# Altium project Milander_DebugBoardV1.PrjPcb
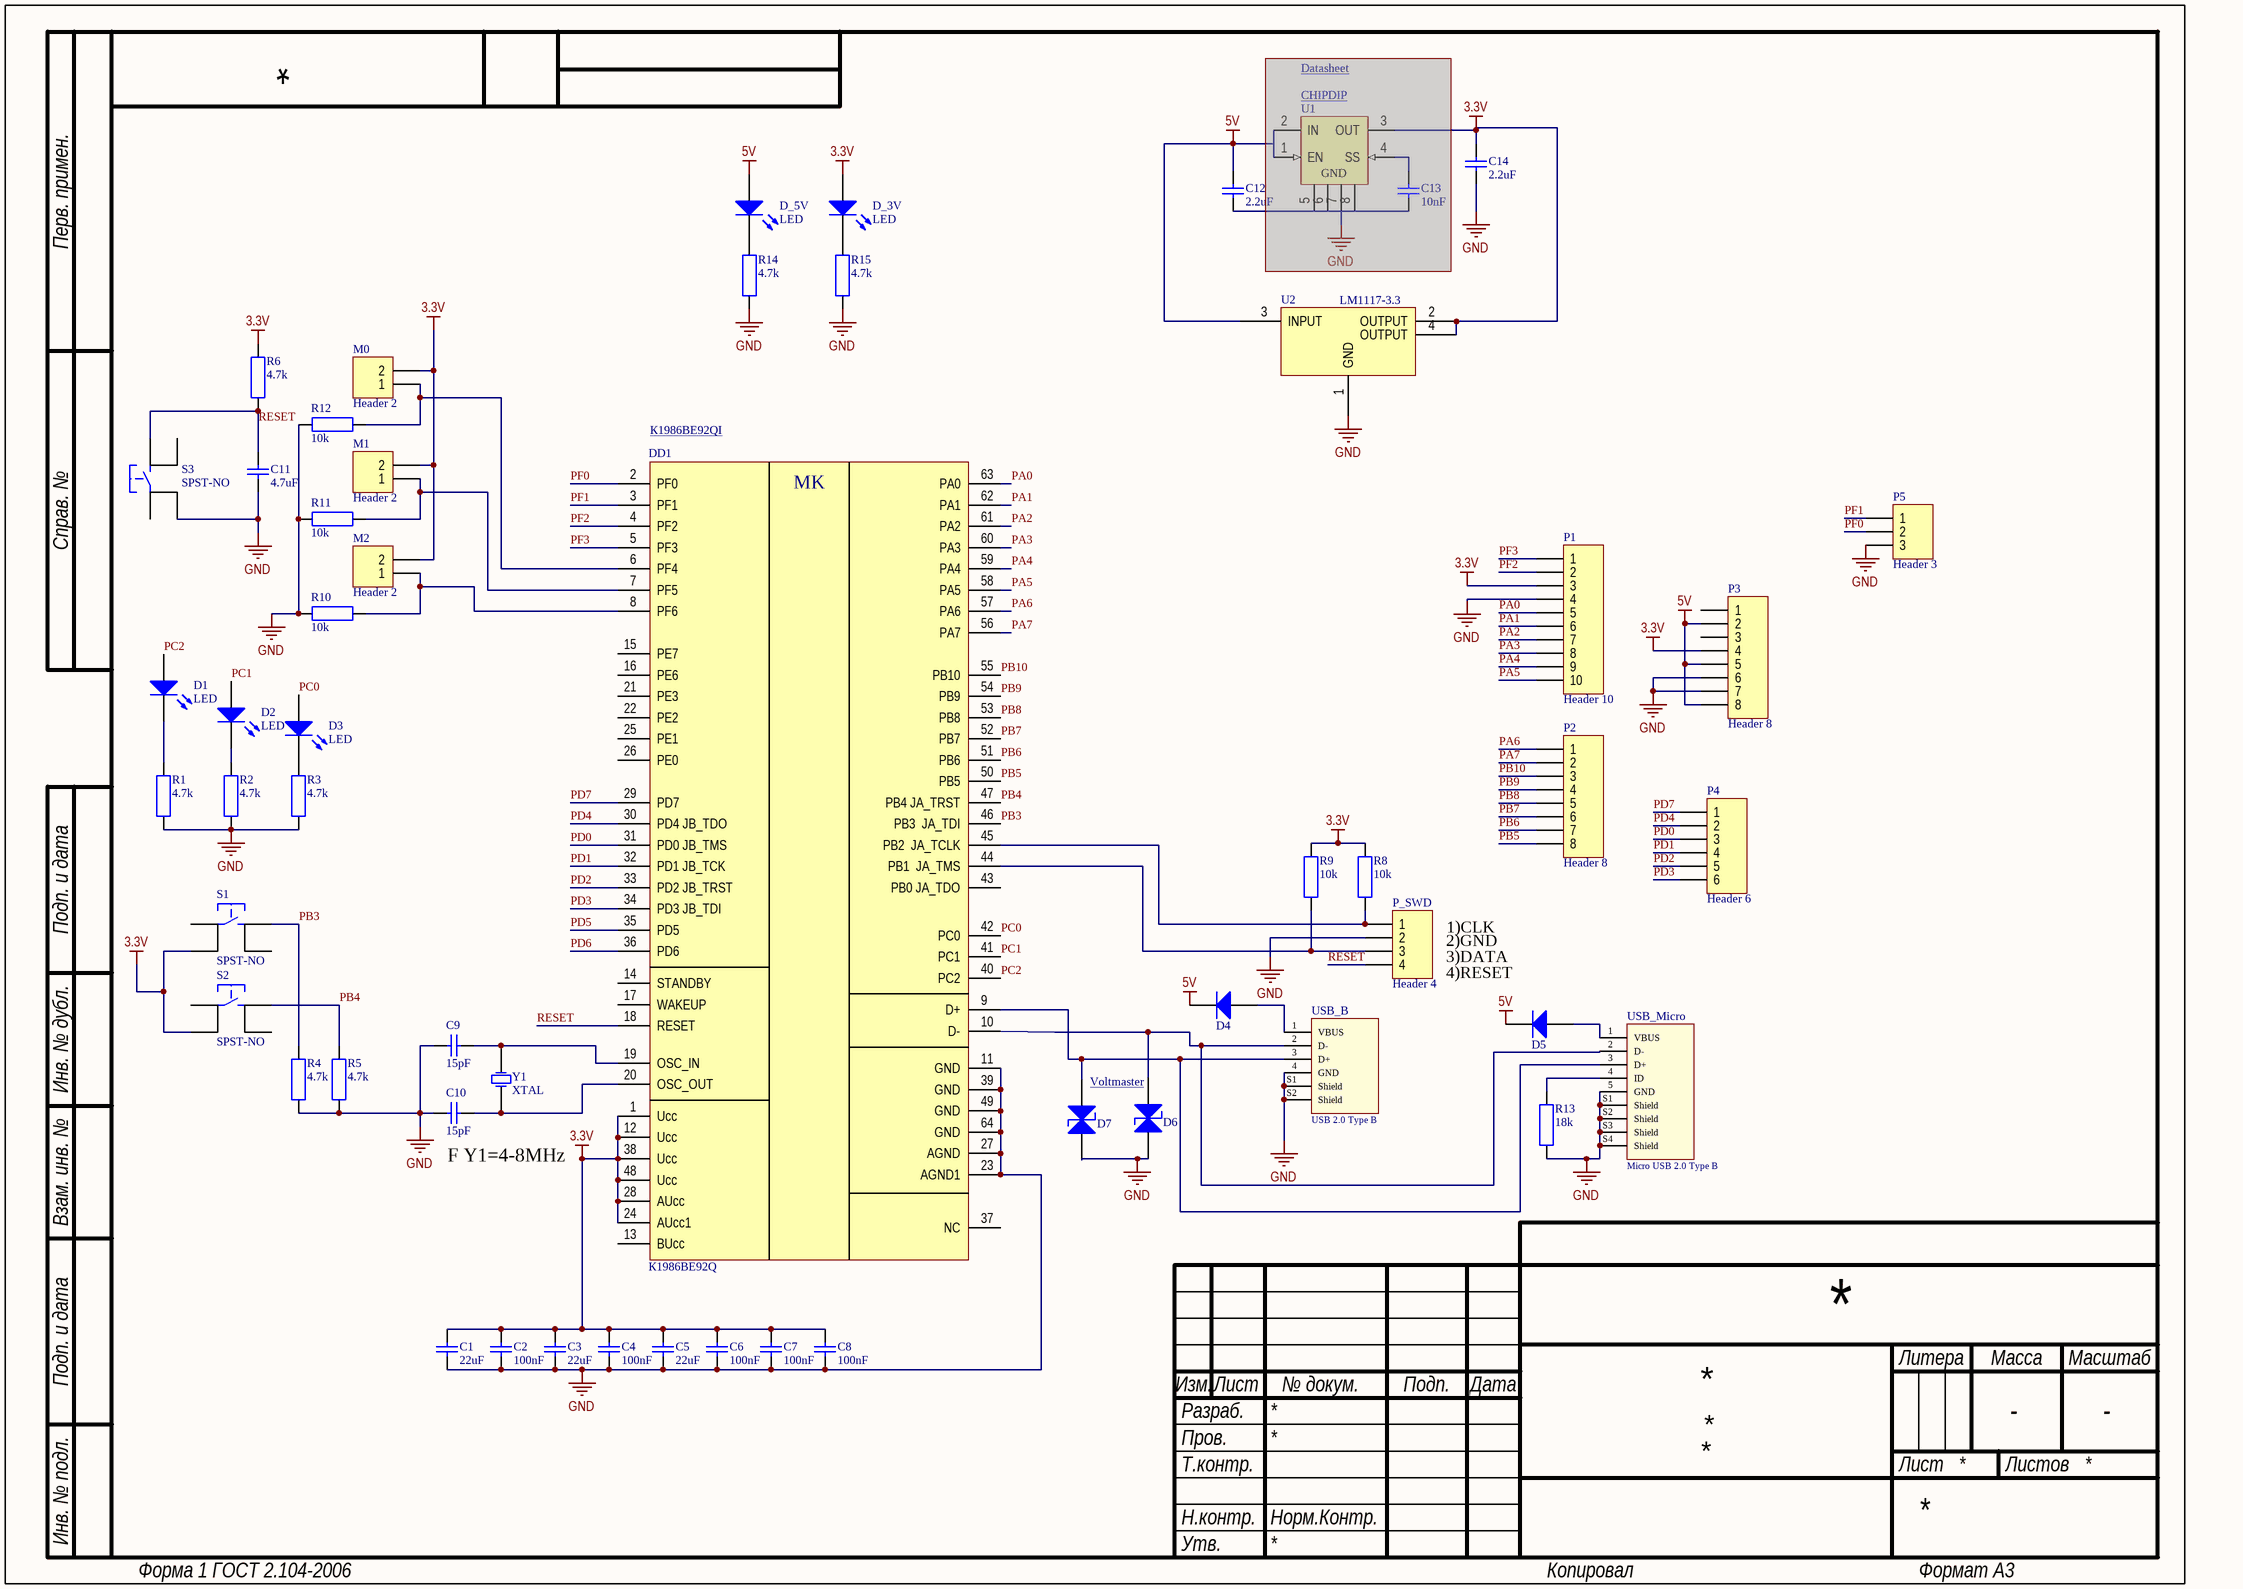
[diagram p0: SCH_BoargV1_2.SchDoc]
2 sheets, 112 parts. Net scope: global (net labels, ports and power ports of the same name join across sheets).
Board files: PCB_BoargV1.PcbDoc, PCB_BoargV1_1.PcbDoc, PCB_BoargV1_2.PcbDoc, PCB_BoargV1_3.PcbDoc
Sheets:
  SCH_BoargV1_2.SchDoc
  SCH_BoargV1.SchDoc

## Sheet SCH_BoargV1_2.SchDoc
size 420 x 297 mm; PageSetup: Record=PageOptions|CenterHorizontal=True|CenterVertical=True|PrintScale=1.00|XCorrection=1.00|YCorrection=1.00|PrintKind=1|BorderSize=5000000|LeftOffset=0|BottomOffset=0|Orientation=2|PaperLength=1000|PaperWidth=1000|Scale=100|PaperSource=15|PrintQuality=1200|MediaType=1|DitherType=10|PaperKind=A3|PrintScaleMode=1; Weight: -; ScaleFactor: -; NormInspection: Норм.Контр.; Scale: 1:1; Разраб.: Иванов; Обозначение документа: АБВГ.123456.001 Э3; Пров.: Петров; Утв.: Сидоров; Наименование организации: ОАО "Концерн "МПО-Гидроприбор"; Перв. применение: АБВГ.123456.000; Наименование изделия 1: Плата; Наименование изделия 2: Схема электрическая; Наименование изделия 3: принципиальная; Нач. отд.: Нач. отд.; Фамилия нач. отд.: Сидоров

### Parts
(Parts that share a designator on the sheet are numbered #1, #2 ... from top to bottom, then left to right.)
C1#1  value 22uF  [C0805C]  (hidden comment: CAP)
C2#1  value 100nF  [C0805C]  (hidden comment: CAP)
C3#1  value 22uF  [C0805C]  (hidden comment: CAP)
C4#1  value 100nF  [C0805C]  (hidden comment: CAP)
C5#1  value 22uF  [C0805C]  (hidden comment: CAP)
C6#1  value 100nF  [C0805C]  (hidden comment: CAP)
C7#1  value 100nF  [C0805C]  (hidden comment: CAP)
C8#1  value 100nF  [C0805C]  (hidden comment: CAP)
C9#1  value 15pF  [C0805C]  (hidden comment: CAP)
C10#1  value 15pF  [C0805C]  (hidden comment: CAP)
C11#1  value 4.7uF  [C0805C]  (hidden comment: CAP)
C12#1  value 2.2uF  [C0805C]  (hidden comment: CAP)
C13#1  value 10nF  [C0805C]  (hidden comment: CAP)  (masked out: inside a compile mask, not in the netlist)
C14#1  value 2.2uF  [C0805C]  (hidden comment: CAP)
D1#1  LED  [LED1206G]
D2#1  LED  [LED1206R]
D3#1  LED  [LED1206Y]
D4#1  Diode  [DSO-C2/X1.8]  (value not drawn)
D5#1  Diode  [DSO-C2/X1.8]  (value not drawn)
D6#1  DiodeTVS  [DIOM4336X22N]  (value not drawn)
D7#1  DiodeTVS  [DIOM4336X22N]  (value not drawn)
D_3V#1  LED  [LED1206R]
D_5V#1  LED  [LED1206R]
DD1#1  К1986ВЕ92Q  [TSQFP50P1200X1200X160-64N]
M0#1  Header 2  [HDR1X2J]
M1#1  Header 2  [HDR1X2J]
M2#1  Header 2  [HDR1X2J]
P1#1  Header 10  [HDR1X10]
P2  Header 8  [HDR1X8]
P3  Header 8  [HDR1X8]
P4  Header 6  [HDR1X6]
P5  Header 3  [HDR1X3]
P_SWD#1  Header 4  [HDR1X4]
R1#1  value 4.7k  [C0805R]  (hidden comment: RES)
R2#1  value 4.7k  [C0805R]  (hidden comment: RES)
R3#1  value 4.7k  [C0805R]  (hidden comment: RES)
R4#1  value 4.7k  [C0805R]  (hidden comment: RES)
R5#1  value 4.7k  [C0805R]  (hidden comment: RES)
R6#1  value 4.7k  [C0805R]  (hidden comment: RES)
R8#1  value 10k  [C0805R]  (hidden comment: RES)
R9#1  value 10k  [C0805R]  (hidden comment: RES)
R10#1  value 10k  [C0805R]  (hidden comment: RES)
R11#1  value 10k  [C0805R]  (hidden comment: RES)
R12#1  value 10k  [C0805R]  (hidden comment: RES)
R13#1  value 18k  [C0805R]  (hidden comment: RES)
R14#1  value 4.7k  [C0805R]  (hidden comment: RES)
R15#1  value 4.7k  [C0805R]  (hidden comment: RES)
S1#1  SPST-NO  [SPST-NO]
S2#1  SPST-NO  [SPST-NO]
S3#1  SPST-NO  [SPST-NO]
U1#1  ADP1715ARMZ-3.3-R7  [ADI-RM-8_N]  (value not drawn)  (masked out: inside a compile mask, not in the netlist)
U2  LM1117-3.3  [SOT-223]
USB_B  USB 2.0 Type B  [61400416121]
USB_Micro#1  Micro USB 2.0 Type B  [629105136821]
Y1#1  XTAL  [HC49SMD C]

### Nets
3.3V: C1#1.2 C2#1.2 C3#1.2 C4#1.2 C5#1.2 C6#1.2 C7#1.2 C8#1.2 C14#1.2 D_3V#1.1(A) DD1#1.1(Ucc) DD1#1.12(Ucc) DD1#1.24(AUcc1) DD1#1.28(AUcc) DD1#1.38(Ucc) DD1#1.48(Ucc) M0#1.2 M1#1.2 M2#1.2 P1#1.3 P3.4 R6#1.1 R8#1.2 R9#1.2 S1#1.2 S2#1.2 U2.2(OUTPUT) U2.4(OUTPUT)
5V: C12#1.2 D4#1.K D5#1.K D_5V#1.1(A) P3.2 P3.5 P3.8 U2.3(INPUT)
GND: C1#1.1 C2#1.1 C3#1.1 C4#1.1 C5#1.1 C6#1.1 C7#1.1 C8#1.1 C9#1.2 C10#1.2 C11#1.1 C14#1.1 D6#1.A D7#1.A DD1#1.11(GND) DD1#1.23(AGND1) DD1#1.27(AGND) DD1#1.39(GND) DD1#1.49(GND) DD1#1.64(GND) P1#1.4 P3.6 P3.7 P5.3 P_SWD#1.2 R1#1.1 R2#1.1 R3#1.1 R4#1.1 R5#1.1 R10#1.2 R11#1.1 R12#1.1 R13#1.1 R14#1.1 R15#1.1 S3#1.2 U2.1(GND) USB_B.4(GND) USB_B.S1(Shield) USB_B.S2(Shield) USB_Micro#1.5(GND) USB_Micro#1.S1(Shield) USB_Micro#1.S2(Shield) USB_Micro#1.S3(Shield) USB_Micro#1.S4(Shield)
PA0: DD1#1.63(PA0) P1#1.5
PA1: DD1#1.62(PA1) P1#1.6
PA2: DD1#1.61(PA2) P1#1.7
PA3: DD1#1.60(PA3) P1#1.8
PA4: DD1#1.59(PA4) P1#1.9
PA5: DD1#1.58(PA5) P1#1.10
PA6: DD1#1.57(PA6) P2.1
PA7: DD1#1.56(PA7) P2.2
PB3: DD1#1.46(PB3__JA_TDI) R4#1.2 S1#1.4
PB4: DD1#1.47(PB4_JA_TRST) R5#1.2 S2#1.4
PB5: DD1#1.50(PB5) P2.8
PB6: DD1#1.51(PB6) P2.7
PB7: DD1#1.52(PB7) P2.6
PB8: DD1#1.53(PB8) P2.5
PB9: DD1#1.54(PB9) P2.4
PB10: DD1#1.55(PB10) P2.3
PC0: D3#1.1(A) DD1#1.42(PC0)
PC1: D2#1.1(A) DD1#1.41(PC1)
PC2: D1#1.1(A) DD1#1.40(PC2)
PD0: DD1#1.31(PD0_JB_TMS) P4.3
PD1: DD1#1.32(PD1_JB_TCK) P4.4
PD2: DD1#1.33(PD2_JB_TRST) P4.5
PD3: DD1#1.34(PD3_JB_TDI) P4.6
PD4: DD1#1.30(PD4_JB_TDO) P4.2
PD5: DD1#1.35(PD5)
PD6: DD1#1.36(PD6)
PD7: DD1#1.29(PD7) P4.1
PF0: DD1#1.2(PF0) P5.2
PF1: DD1#1.3(PF1) P5.1
PF2: DD1#1.4(PF2) P1#1.2
PF3: DD1#1.5(PF3) P1#1.1
RESET: C11#1.2 DD1#1.18(RESET) P_SWD#1.4 R6#1.2 S3#1.4
NetC9#1_1: C9#1.1 DD1#1.19(OSC_IN) Y1#1.2(OSC2)
NetC10#1_1: C10#1.1 DD1#1.20(OSC_OUT) Y1#1.1(OSC1)
NetD1#1_2: D1#1.2(K) R1#1.2
NetD2#1_2: D2#1.2(K) R2#1.2
NetD3#1_2: D3#1.2(K) R3#1.2
NetD4#1_A: D4#1.A USB_B.1(VBUS)
NetD5#1_A: D5#1.A USB_Micro#1.1(VBUS)
NetD6#1_K: D6#1.K DD1#1.10(D-) USB_B.2(D-) USB_Micro#1.2(D-)
NetD7#1_K: D7#1.K DD1#1.9(D+) USB_B.3(D+) USB_Micro#1.3(D+)
NetD_3V#1_2: D_3V#1.2(K) R15#1.2
NetD_5V#1_2: D_5V#1.2(K) R14#1.2
NetDD1#1_6: DD1#1.6(PF4) M0#1.1 R12#1.2
NetDD1#1_7: DD1#1.7(PF5) M1#1.1 R11#1.2
NetDD1#1_8: DD1#1.8(PF6) M2#1.1 R10#1.1
NetDD1#1_44: DD1#1.44(PB1__JA_TMS) P_SWD#1.3 R9#1.1
NetDD1#1_45: DD1#1.45(PB2__JA_TCLK) P_SWD#1.1 R8#1.1
NetR13#1_2: R13#1.2 USB_Micro#1.4(ID)

Not connected (* = marked no-connect by the designer): C12#1 1; DD1#1 13(BUcc) 14(STANDBY) 15(PE7) 16(PE6) 17(WAKEUP) 21(PE3) 22(PE2) 25(PE1) 26(PE0) 37(NC) 43(PB0_JA_TDO); P3 1 3; S1#1 1 3; S2#1 1 3; S3#1 1 3

### Notes on the sheet
- Datasheet <https://www.analog.com/media/en/technical-documentation/data-sheets/ADP1715_1716.pdf>
- (near U1#1) CHIPDIP <https://www.chipdip.ru/product1/8001055314>
- (near DD1#1) К1986ВЕ92QI <https://ic.milandr.ru/products/mikrokontrollery_i_protsessory/k1986ve92qi/>
- 1)CLK
- 3)DATA
- (near P_SWD#1) 2)GND
- 4)RESET
- Voltmaster <http://www.voltmaster.ru/cgi-bin/qwery.pl/id=2010076902>
- (near C10#1) F Y1=4-8MHz
- Перв. примен.
- Справ. №
- Подп. и дата
- Инв. № дубл.
- Взам. инв. №
- Разраб.
- Изм.
- Лист
- № докум.
- Подп.
- Дата
- Литера
- Масса
- Масштаб
- Пров.
- Т.контр.
- Листов
- Инв. № подл.
- Н.контр.
- Утв.
- Форма 1 ГОСТ 2.104-2006
- Копировал
- Формат А3
- (in symbol К1986ВЕ92Q) MK

### Library data of the parts
C1#1 C2#1 C3#1 C4#1 C5#1 C6#1 C7#1 C8#1 C9#1 C10#1 C11#1 C12#1 C13#1 C14#1 = CAP: Capacitor; Published: 8-Jun-2000; LatestRevisionDate: 29-May-2009; LatestRevisionNote: IPC-7351 Footprint Added.; PackageReference: C1206; Publisher: Altium Limited; PackageDescription: Chip Capacitor
D1#1 D2#1 D3#1 D_3V#1 D_5V#1 = LED: Typical LED; Published: 8-Jun-2000; LatestRevisionDate: 17-Jul-2002; LatestRevisionNote: Re-released for DXP Platform.; PackageVersion: Feb-2002; PackageReference: 3.2X1.6X1.1; Publisher: Altium Limited; PackageDescription: SM LED; 2 Flat Leads
D4#1 D5#1 = Diode: Default Diode; Published: 8-Jun-2000; LatestRevisionDate: 17-Jul-2002; LatestRevisionNote: Re-released for DXP Platform.; PackageVersion: Sep-1996; PackageReference: SMC; Publisher: Altium Limited; PackageDescription: DO-214-AB/SMC; 2 C-Bend Leads; Body 7.9 x 5.9 mm, inc. leads (LxW); Code_JEDEC: DO-214-AB
D6#1 D7#1 = DiodeTVS: Diode TVS; Published: 8-Jun-2000; LatestRevisionDate: 17-Jul-2002; LatestRevisionNote: Re-released for DXP Platform.; PackageVersion: Sep-1996; PackageReference: SMC; Publisher: Altium Limited; PackageDescription: DO-214-AB/SMC; 2 C-Bend Leads; Body 7.9 x 5.9 mm, inc. leads (LxW); Code_JEDEC: DO-214-AB
M0#1 M1#1 M2#1 = Header 2: Header, 2-Pin; LatestRevisionDate: 17-Jul-2002; LatestRevisionNote: Re-released for DXP Platform.; Publisher: Altium Limited
P1#1 = Header 10: Header, 10-Pin; LatestRevisionDate: 17-Jul-2002; LatestRevisionNote: Re-released for DXP Platform.; Publisher: Altium Limited
P2 P3 = Header 8: Header, 8-Pin; LatestRevisionDate: 17-Jul-2002; LatestRevisionNote: Re-released for DXP Platform.; Publisher: Altium Limited
P4 = Header 6: Header, 6-Pin; LatestRevisionDate: 17-Jul-2002; LatestRevisionNote: Re-released for DXP Platform.; Publisher: Altium Limited
P5 = Header 3: Header, 3-Pin; LatestRevisionDate: 17-Jul-2002; LatestRevisionNote: Re-released for DXP Platform.; Publisher: Altium Limited
P_SWD#1 = Header 4: Header, 4-Pin; LatestRevisionDate: 17-Jul-2002; LatestRevisionNote: Re-released for DXP Platform.; Publisher: Altium Limited
R1#1 R2#1 R3#1 R4#1 R5#1 R6#1 R8#1 R9#1 R10#1 R11#1 R12#1 R13#1 R14#1 R15#1 = RES: Resistor; Published: 8-Jun-2000; LatestRevisionDate: 29-May-2009; LatestRevisionNote: IPC-7351 Footprint Added.; PackageReference: J1-0603; Publisher: Altium Limited; PackageDescription: Chip Resistor
S1#1 S2#1 S3#1 = SPST-NO: Tactile Switch 7.3mm, SMD
U1#1 = ADP1715ARMZ-3.3-R7: 500 mA, Low Dropout, CMOS Linear Regulator, 2.5 to 5.5 V Vin, 3.3 V Vout, Industrial, 8-pin SOP (RM-8), Reel; Manufacturer: Analog Devices; Iout max: 500mA; Preset Vout Values (V): 3.3; Supply Current IGND @ Small Load: 65uA; Vin (max) (V): 5.5; Vin (min) (V): 2.5; DatasheetVersion: Rev. 0; PackageVersion: Aug-05; PackageReference: RM-8; PackageDescription: 8-Pin Mini Small Outline Package, Body 3 x 3 mm, Pitch 0.65 mm; Supplier 1: Digi-Key; Supplier Part Number 1: ADP1715ARMZ-3.3-R7TR-ND; Supplier 2: Digi-Key; Supplier Part Number 2: ADP1715ARMZ-3.3-R7CT-ND; Supplier 3: Digi-Key; Supplier Part Number 3: ADP1715ARMZ-3.3-R7DKR-ND; Supplier 4: Farnell; Supplier Part Number 4: 2376927; Supplier 5: Newark; Supplier Part Number 5: 23X6019; Supplier 6: Newark; Supplier Part Number 6: 28M3820; Supplier 7: Mouser; Supplier Part Number 7: 584-ADP1715ARMZ3.3R7; Packing: Reel; Mounting Technology: Surface Mount; Code_JEDEC: MO-187-AA; PartNumber: ADP1715ARMZ-3.3-R7; ComponentLink1Description: Manufacturer URL; ComponentLink1URL: http://www.analog.com/en/index.html; ComponentLink2Description: Datasheet; ComponentLink2URL: http://www.analog.com/static/imported-files/data_sheets/ADP1715_1716.pdf; ComponentLink3Description: Package Specification; ComponentLink3URL: http://www.analog.com/static/imported-files/packages/PKG_PDF/MSOP%28RM%29/RM_8.pdf; ComponentLink4Description: URL Link1; ComponentLink4URL: Product URL:http://www.analog.com/en/ADP1715/productSearch.html
U2 = LM1117-3.3: 500 mA Low Dropout Regulator
USB_B = 61400416121: USB 2.0 Type B Horizontal THT WR-COM; Rated Current: 1.5 A; Gender: Female; ComponentLink1Description: Manufacturer; ComponentLink1URL: http://www.we-online.de; ComponentLink2Description: Datasheet; ComponentLink2URL: http://katalog.we-online.de/em/datasheet/61400416121.pdf; Part Number: 61400416121; Published Date: May 2018; Publisher: Wurth Elektronik; Orientation: Horizontal; Interface Type: USB 2.0 Type B; Operating Temperature: -40 to 105 degC; Mounting Technology: THT; Packaging: Tray
USB_Micro#1 = 629105136821: Micro USB 2.0 Type B Horizontal SMT 5 Contacts WR-COM; Rated Current: 1 A; Gender: Female; ComponentLink1Description: Manufacturer; ComponentLink1URL: http://www.we-online.de; ComponentLink2Description: Datasheet; ComponentLink2URL: http://katalog.we-online.de/em/datasheet/629105136821.pdf; Part Number: 629105136821; Published Date: May 2018; Publisher: Wurth Elektronik; Orientation: Horizontal; Interface Type: Micro USB 2.0 Type B; Operating Temperature: -40 to 85 degC; Mounting Technology: SMT; Packaging: Tape and Reel
Y1#1 = XTAL: Crystal Oscillator; Published: 8-Jun-2000; LatestRevisionDate: 17-Jul-2002; LatestRevisionNote: Re-released for DXP Platform.; PackageReference: R38; Publisher: Altium Limited; PackageDescription: Crystal, Thru-Hole; 2 Leads; Body 3.1 x 8.2 mm (Dia.xH)

## Sheet SCH_BoargV1.SchDoc
size 420 x 297 mm; PageSetup: Record=PageOptions|CenterHorizontal=True|CenterVertical=True|PrintScale=1.00|XCorrection=1.00|YCorrection=1.00|PrintKind=1|BorderSize=5000000|LeftOffset=0|BottomOffset=0|Orientation=2|PaperLength=1000|PaperWidth=1000|Scale=100|PaperSource=15|PrintQuality=1200|MediaType=1|DitherType=10|PaperKind=A3|PrintScaleMode=1; Weight: -; ScaleFactor: -; NormInspection: Норм.Контр.; Scale: 1:1; Разраб.: Иванов; Обозначение документа: АБВГ.123456.001 Э3; Пров.: Петров; Утв.: Сидоров; Наименование организации: ОАО "Концерн "МПО-Гидроприбор"; Перв. применение: АБВГ.123456.000; Наименование изделия 1: Плата; Наименование изделия 2: Схема электрическая; Наименование изделия 3: принципиальная; Нач. отд.: Нач. отд.; Фамилия нач. отд.: Сидоров
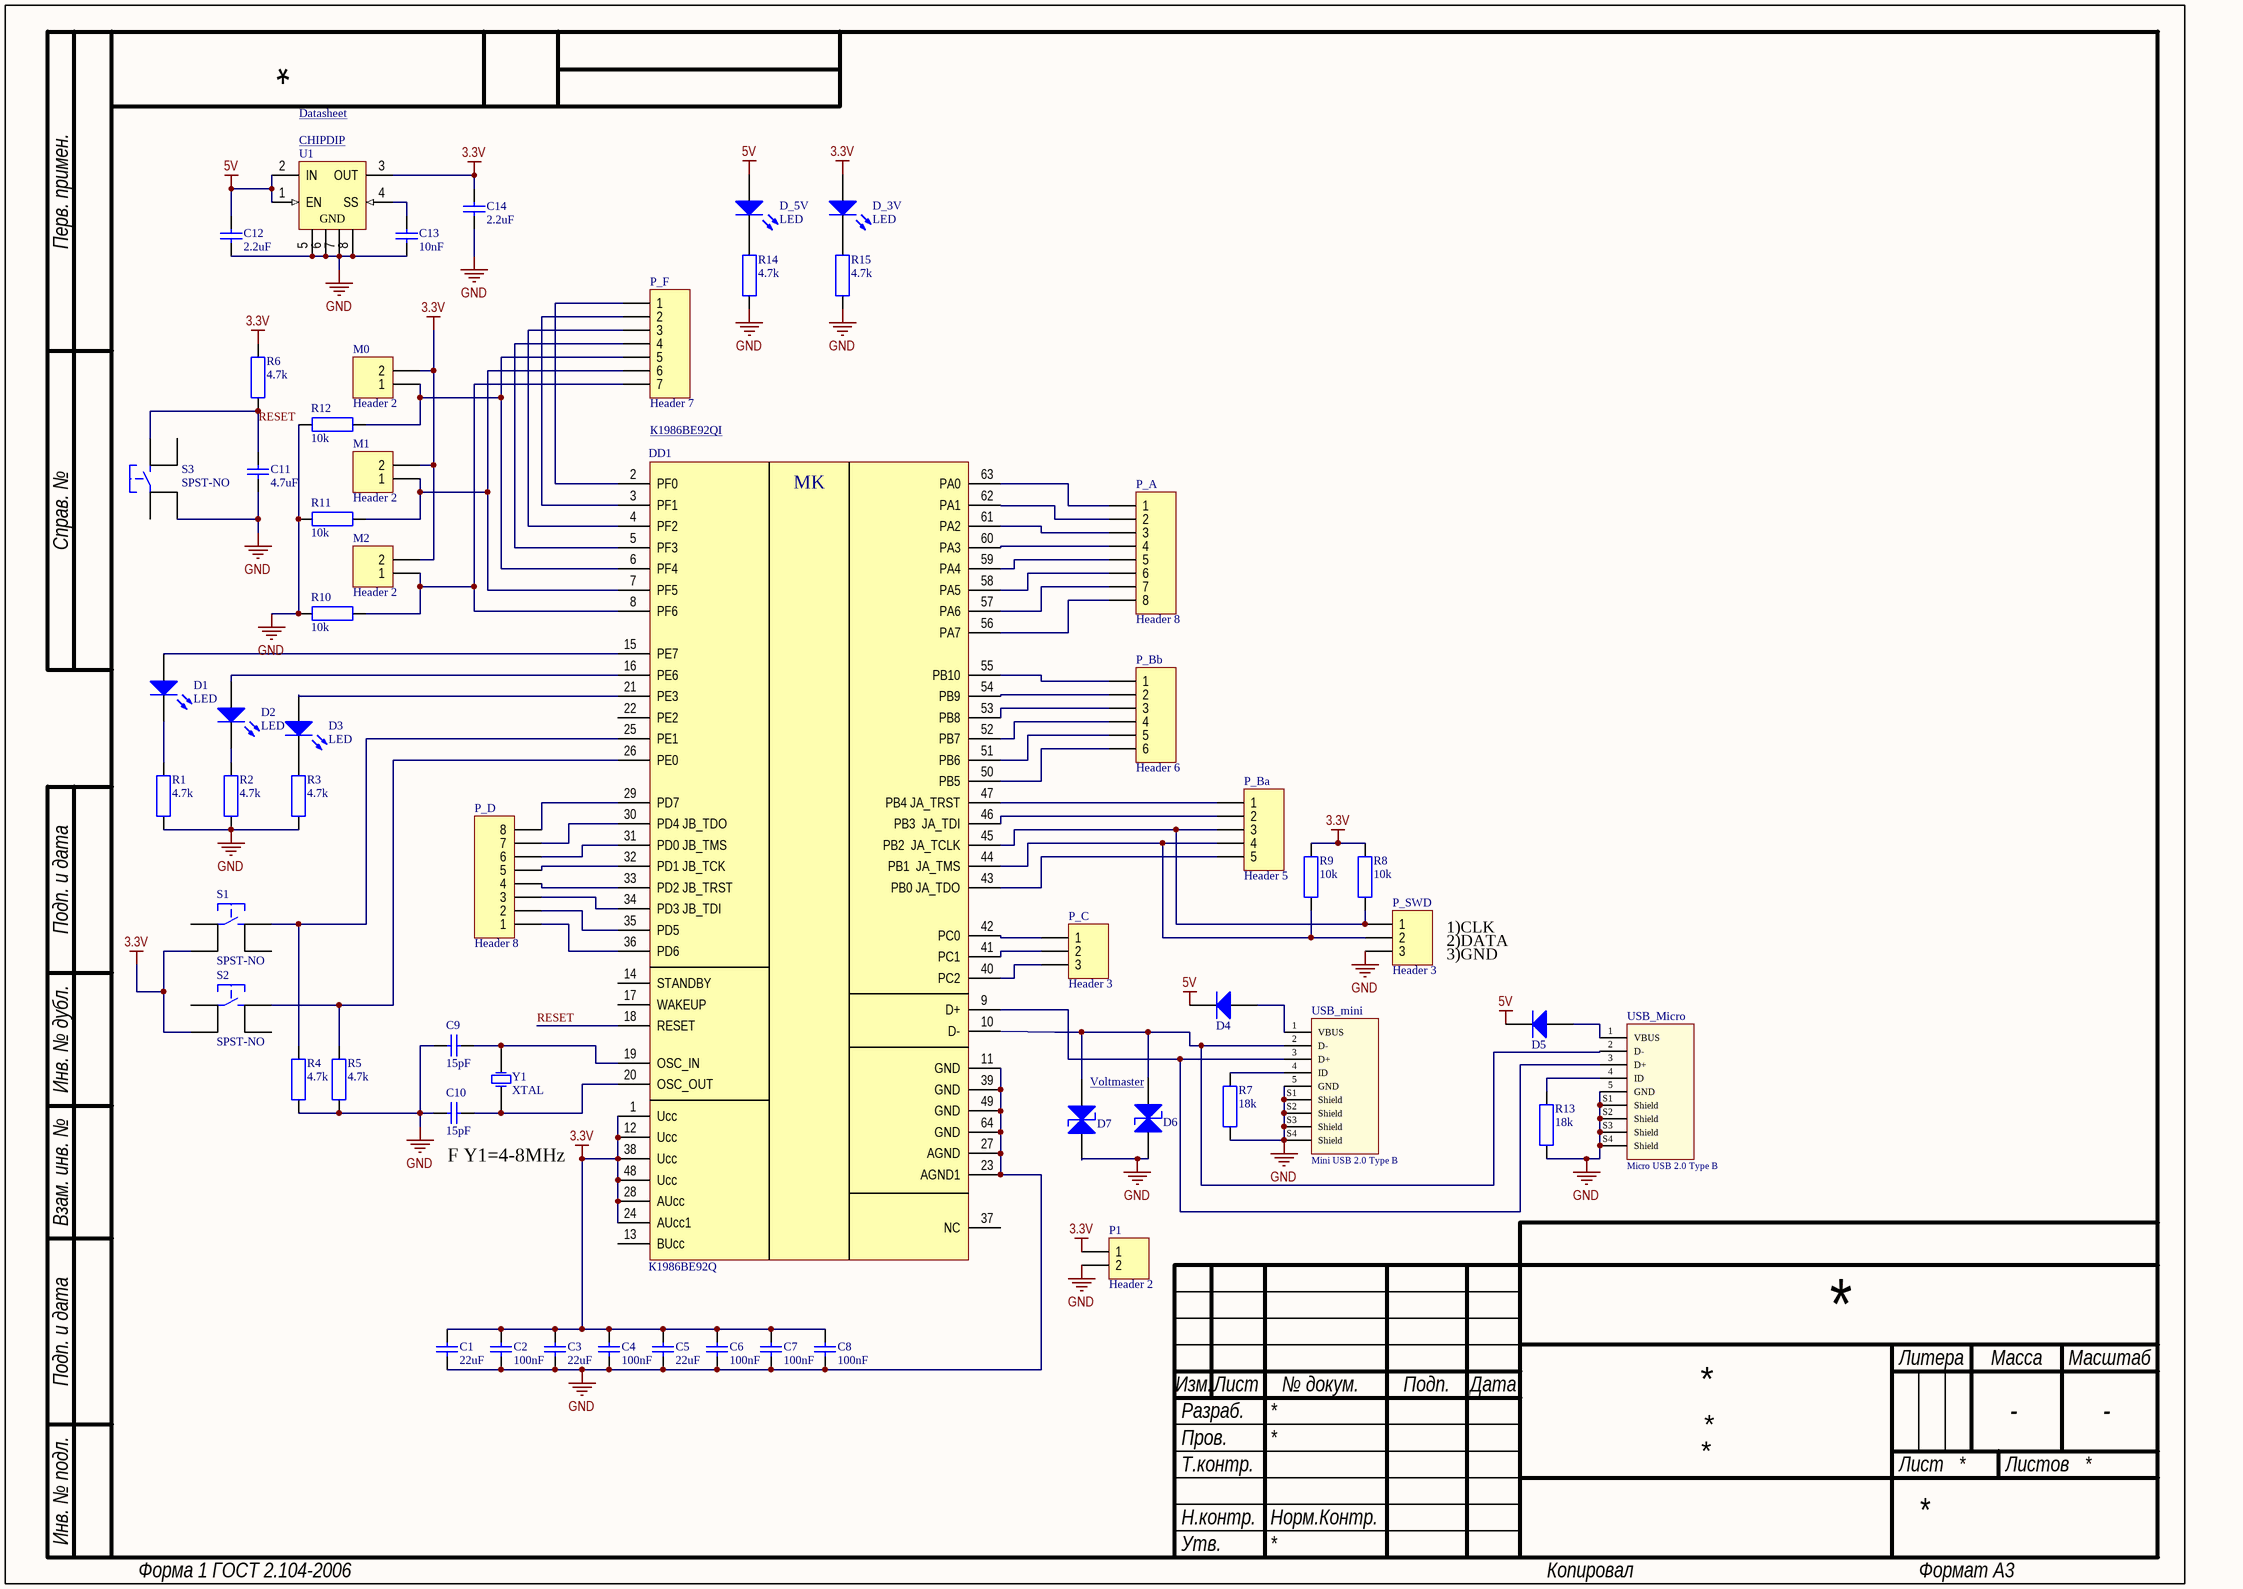
[diagram p1: SCH_BoargV1.SchDoc]

### Parts
(Parts that share a designator on the sheet are numbered #1, #2 ... from top to bottom, then left to right.)
C1#2  value 22uF  [C0805C]  (hidden comment: CAP)
C2#2  value 100nF  [C0805C]  (hidden comment: CAP)
C3#2  value 22uF  [C0805C]  (hidden comment: CAP)
C4#2  value 100nF  [C0805C]  (hidden comment: CAP)
C5#2  value 22uF  [C0805C]  (hidden comment: CAP)
C6#2  value 100nF  [C0805C]  (hidden comment: CAP)
C7#2  value 100nF  [C0805C]  (hidden comment: CAP)
C8#2  value 100nF  [C0805C]  (hidden comment: CAP)
C9#2  value 15pF  [C0805C]  (hidden comment: CAP)
C10#2  value 15pF  [C0805C]  (hidden comment: CAP)
C11#2  value 4.7uF  [C0805C]  (hidden comment: CAP)
C12#2  value 2.2uF  [C0805C]  (hidden comment: CAP)
C13#2  value 10nF  [C0805C]  (hidden comment: CAP)
C14#2  value 2.2uF  [C0805C]  (hidden comment: CAP)
D1#2  LED  [LED1206G]
D2#2  LED  [LED1206R]
D3#2  LED  [LED1206Y]
D4#2  Diode  [DSO-C2/X1.8]  (value not drawn)
D5#2  Diode  [DSO-C2/X1.8]  (value not drawn)
D6#2  DiodeTVS  [DIOM4336X22N]  (value not drawn)
D7#2  DiodeTVS  [DIOM4336X22N]  (value not drawn)
D_3V#2  LED  [LED1206R]
D_5V#2  LED  [LED1206R]
DD1#2  К1986ВЕ92Q  [TSQFP50P1200X1200X160-64N]
M0#2  Header 2  [HDR1X2J]
M1#2  Header 2  [HDR1X2J]
M2#2  Header 2  [HDR1X2J]
P1#2  Header 2  [HDR1X2]
P_A  Header 8  [HDR1X8]
P_Ba  Header 5  [HDR1X5]
P_Bb  Header 6  [HDR1X6]
P_C  Header 3  [HDR1X3]
P_D  Header 8  [HDR1X8]
P_F  Header 7  [HDR1X7]
P_SWD#2  Header 3  [HDR1X3]
R1#2  value 4.7k  [C0805R]  (hidden comment: RES)
R2#2  value 4.7k  [C0805R]  (hidden comment: RES)
R3#2  value 4.7k  [C0805R]  (hidden comment: RES)
R4#2  value 4.7k  [C0805R]  (hidden comment: RES)
R5#2  value 4.7k  [C0805R]  (hidden comment: RES)
R6#2  value 4.7k  [C0805R]  (hidden comment: RES)
R7  value 18k  [C0805R]  (hidden comment: RES)
R8#2  value 10k  [C0805R]  (hidden comment: RES)
R9#2  value 10k  [C0805R]  (hidden comment: RES)
R10#2  value 10k  [C0805R]  (hidden comment: RES)
R11#2  value 10k  [C0805R]  (hidden comment: RES)
R12#2  value 10k  [C0805R]  (hidden comment: RES)
R13#2  value 18k  [C0805R]  (hidden comment: RES)
R14#2  value 4.7k  [C0805R]  (hidden comment: RES)
R15#2  value 4.7k  [C0805R]  (hidden comment: RES)
S1#2  SPST-NO  [SPST-NO]
S2#2  SPST-NO  [SPST-NO]
S3#2  SPST-NO  [SPST-NO]
U1#2  ADP1715ARMZ-3.3-R7  [ADI-RM-8_N]  (value not drawn)
USB_Micro#2  Micro USB 2.0 Type B  [629105136821]
USB_mini  Mini USB 2.0 Type B  [65100516121]
Y1#2  XTAL  [HC49SMD C]

### Nets
3.3V: C1#2.2 C2#2.2 C3#2.2 C4#2.2 C5#2.2 C6#2.2 C7#2.2 C8#2.2 C14#2.2 D_3V#2.1(A) DD1#2.1(Ucc) DD1#2.12(Ucc) DD1#2.24(AUcc1) DD1#2.28(AUcc) DD1#2.38(Ucc) DD1#2.48(Ucc) M0#2.2 M1#2.2 M2#2.2 P1#2.1 R6#2.1 R8#2.2 R9#2.2 S1#2.2 S2#2.2 U1#2.3(OUT)
5V: C12#2.2 D4#2.K D5#2.K D_5V#2.1(A) U1#2.1(EN) U1#2.2(IN)
GND: C1#2.1 C2#2.1 C3#2.1 C4#2.1 C5#2.1 C6#2.1 C7#2.1 C8#2.1 C9#2.2 C10#2.2 C11#2.1 C12#2.1 C13#2.1 C14#2.1 D6#2.A D7#2.A DD1#2.11(GND) DD1#2.23(AGND1) DD1#2.27(AGND) DD1#2.39(GND) DD1#2.49(GND) DD1#2.64(GND) P1#2.2 P_SWD#2.3 R1#2.1 R2#2.1 R3#2.1 R4#2.1 R5#2.1 R7.1 R10#2.2 R11#2.1 R12#2.1 R13#2.1 R14#2.1 R15#2.1 S3#2.2 U1#2.5(GND) U1#2.6(GND) U1#2.7(GND) U1#2.8(GND) USB_Micro#2.5(GND) USB_Micro#2.S1(Shield) USB_Micro#2.S2(Shield) USB_Micro#2.S3(Shield) USB_Micro#2.S4(Shield) USB_mini.5(GND) USB_mini.S1(Shield) USB_mini.S2(Shield) USB_mini.S3(Shield) USB_mini.S4(Shield)
RESET: C11#2.2 DD1#2.18(RESET) R6#2.2 S3#2.4
NetC9#2_1: C9#2.1 DD1#2.19(OSC_IN) Y1#2.2(OSC2)
NetC10#2_1: C10#2.1 DD1#2.20(OSC_OUT) Y1#2.1(OSC1)
NetC13#2_2: C13#2.2 U1#2.4(SS)
NetD1#2_1: D1#2.1(A) DD1#2.15(PE7)
NetD1#2_2: D1#2.2(K) R1#2.2
NetD2#2_1: D2#2.1(A) DD1#2.16(PE6)
NetD2#2_2: D2#2.2(K) R2#2.2
NetD3#2_1: D3#2.1(A) DD1#2.21(PE3)
NetD3#2_2: D3#2.2(K) R3#2.2
NetD4#2_A: D4#2.A USB_mini.1(VBUS)
NetD5#2_A: D5#2.A USB_Micro#2.1(VBUS)
NetD6#2_K: D6#2.K D7#2.K DD1#2.10(D-) USB_Micro#2.2(D-) USB_mini.2(D-)
NetD_3V#2_2: D_3V#2.2(K) R15#2.2
NetD_5V#2_2: D_5V#2.2(K) R14#2.2
NetDD1#2_2: DD1#2.2(PF0) P_F.1
NetDD1#2_3: DD1#2.3(PF1) P_F.2
NetDD1#2_4: DD1#2.4(PF2) P_F.3
NetDD1#2_5: DD1#2.5(PF3) P_F.4
NetDD1#2_6: DD1#2.6(PF4) M0#2.1 P_F.5 R12#2.2
NetDD1#2_7: DD1#2.7(PF5) M1#2.1 P_F.6 R11#2.2
NetDD1#2_8: DD1#2.8(PF6) M2#2.1 P_F.7 R10#2.1
NetDD1#2_9: DD1#2.9(D+) USB_Micro#2.3(D+) USB_mini.3(D+)
NetDD1#2_25: DD1#2.25(PE1) R4#2.2 S1#2.4
NetDD1#2_26: DD1#2.26(PE0) R5#2.2 S2#2.4
NetDD1#2_29: DD1#2.29(PD7) P_D.8
NetDD1#2_30: DD1#2.30(PD4_JB_TDO) P_D.7
NetDD1#2_31: DD1#2.31(PD0_JB_TMS) P_D.6
NetDD1#2_32: DD1#2.32(PD1_JB_TCK) P_D.5
NetDD1#2_33: DD1#2.33(PD2_JB_TRST) P_D.4
NetDD1#2_34: DD1#2.34(PD3_JB_TDI) P_D.3
NetDD1#2_35: DD1#2.35(PD5) P_D.2
NetDD1#2_36: DD1#2.36(PD6) P_D.1
NetDD1#2_40: DD1#2.40(PC2) P_C.3
NetDD1#2_41: DD1#2.41(PC1) P_C.2
NetDD1#2_42: DD1#2.42(PC0) P_C.1
NetDD1#2_43: DD1#2.43(PB0_JA_TDO) P_Ba.5
NetDD1#2_44: DD1#2.44(PB1__JA_TMS) P_Ba.4 P_SWD#2.2 R9#2.1
NetDD1#2_45: DD1#2.45(PB2__JA_TCLK) P_Ba.3 P_SWD#2.1 R8#2.1
NetDD1#2_46: DD1#2.46(PB3__JA_TDI) P_Ba.2
NetDD1#2_47: DD1#2.47(PB4_JA_TRST) P_Ba.1
NetDD1#2_50: DD1#2.50(PB5) P_Bb.6
NetDD1#2_51: DD1#2.51(PB6) P_Bb.5
NetDD1#2_52: DD1#2.52(PB7) P_Bb.4
NetDD1#2_53: DD1#2.53(PB8) P_Bb.3
NetDD1#2_54: DD1#2.54(PB9) P_Bb.2
NetDD1#2_55: DD1#2.55(PB10) P_Bb.1
NetDD1#2_56: DD1#2.56(PA7) P_A.8
NetDD1#2_57: DD1#2.57(PA6) P_A.7
NetDD1#2_58: DD1#2.58(PA5) P_A.6
NetDD1#2_59: DD1#2.59(PA4) P_A.5
NetDD1#2_60: DD1#2.60(PA3) P_A.4
NetDD1#2_61: DD1#2.61(PA2) P_A.3
NetDD1#2_62: DD1#2.62(PA1) P_A.2
NetDD1#2_63: DD1#2.63(PA0) P_A.1
NetR7_2: R7.2 USB_mini.4(ID)
NetR13#2_2: R13#2.2 USB_Micro#2.4(ID)

Not connected (* = marked no-connect by the designer): DD1#2 13(BUcc) 14(STANDBY) 17(WAKEUP) 22(PE2) 37(NC); S1#2 1 3; S2#2 1 3; S3#2 1 3

### Notes on the sheet
- Datasheet <https://www.analog.com/media/en/technical-documentation/data-sheets/ADP1715_1716.pdf>
- (near U1#2) CHIPDIP <https://www.chipdip.ru/product1/8001055314>
- К1986ВЕ92QI <https://ic.milandr.ru/products/mikrokontrollery_i_protsessory/k1986ve92qi/>
- 1)CLK
- 2)DATA
- 3)GND
- Voltmaster <http://www.voltmaster.ru/cgi-bin/qwery.pl/id=2010076902>
- (near C10#2) F Y1=4-8MHz
- Перв. примен.
- Справ. №
- Подп. и дата
- Инв. № дубл.
- Взам. инв. №
- Разраб.
- Изм.
- Лист
- № докум.
- Подп.
- Дата
- Литера
- Масса
- Масштаб
- Пров.
- Т.контр.
- Листов
- Инв. № подл.
- Н.контр.
- Утв.
- Форма 1 ГОСТ 2.104-2006
- Копировал
- Формат А3
- (in symbol К1986ВЕ92Q) MK

### Library data of the parts
C1#2 C2#2 C3#2 C4#2 C5#2 C6#2 C7#2 C8#2 C9#2 C10#2 C11#2 C12#2 C13#2 C14#2 = CAP: Capacitor; Published: 8-Jun-2000; LatestRevisionDate: 29-May-2009; LatestRevisionNote: IPC-7351 Footprint Added.; PackageReference: C1206; Publisher: Altium Limited; PackageDescription: Chip Capacitor
D1#2 D2#2 D3#2 D_3V#2 D_5V#2 = LED: Typical LED; Published: 8-Jun-2000; LatestRevisionDate: 17-Jul-2002; LatestRevisionNote: Re-released for DXP Platform.; PackageVersion: Feb-2002; PackageReference: 3.2X1.6X1.1; Publisher: Altium Limited; PackageDescription: SM LED; 2 Flat Leads
D4#2 D5#2 = Diode: Default Diode; Published: 8-Jun-2000; LatestRevisionDate: 17-Jul-2002; LatestRevisionNote: Re-released for DXP Platform.; PackageVersion: Sep-1996; PackageReference: SMC; Publisher: Altium Limited; PackageDescription: DO-214-AB/SMC; 2 C-Bend Leads; Body 7.9 x 5.9 mm, inc. leads (LxW); Code_JEDEC: DO-214-AB
D6#2 D7#2 = DiodeTVS: Diode TVS; Published: 8-Jun-2000; LatestRevisionDate: 17-Jul-2002; LatestRevisionNote: Re-released for DXP Platform.; PackageVersion: Sep-1996; PackageReference: SMC; Publisher: Altium Limited; PackageDescription: DO-214-AB/SMC; 2 C-Bend Leads; Body 7.9 x 5.9 mm, inc. leads (LxW); Code_JEDEC: DO-214-AB
M0#2 M1#2 M2#2 P1#2 = Header 2: Header, 2-Pin; LatestRevisionDate: 17-Jul-2002; LatestRevisionNote: Re-released for DXP Platform.; Publisher: Altium Limited
P_A P_D = Header 8: Header, 8-Pin; LatestRevisionDate: 17-Jul-2002; LatestRevisionNote: Re-released for DXP Platform.; Publisher: Altium Limited
P_Ba = Header 5: Header, 5-Pin; LatestRevisionDate: 17-Jul-2002; LatestRevisionNote: Re-released for DXP Platform.; Publisher: Altium Limited
P_Bb = Header 6: Header, 6-Pin; LatestRevisionDate: 17-Jul-2002; LatestRevisionNote: Re-released for DXP Platform.; Publisher: Altium Limited
P_C P_SWD#2 = Header 3: Header, 3-Pin; LatestRevisionDate: 17-Jul-2002; LatestRevisionNote: Re-released for DXP Platform.; Publisher: Altium Limited
P_F = Header 7: Header, 7-Pin; LatestRevisionDate: 17-Jul-2002; LatestRevisionNote: Re-released for DXP Platform.; Publisher: Altium Limited
R1#2 R2#2 R3#2 R4#2 R5#2 R6#2 R7 R8#2 R9#2 R10#2 R11#2 R12#2 R13#2 R14#2 R15#2 = RES: Resistor; Published: 8-Jun-2000; LatestRevisionDate: 29-May-2009; LatestRevisionNote: IPC-7351 Footprint Added.; PackageReference: J1-0603; Publisher: Altium Limited; PackageDescription: Chip Resistor
S1#2 S2#2 S3#2 = SPST-NO: Tactile Switch 7.3mm, SMD
U1#2 = ADP1715ARMZ-3.3-R7: as U1#1 on sheet SCH_BoargV1_2; DatasheetVersion: Rev. 0; PackageVersion: Aug-05; PackageReference: RM-8; PackageDescription: 8-Pin Mini Small Outline Package, Body 3 x 3 mm, Pitch 0.65 mm; Supplier 1: Digi-Key; Supplier Part Number 1: ADP1715ARMZ-3.3-R7TR-ND; Supplier 2: Digi-Key; Supplier Part Number 2: ADP1715ARMZ-3.3-R7CT-ND; Supplier 3: Digi-Key; Supplier Part Number 3: ADP1715ARMZ-3.3-R7DKR-ND; Supplier 4: Farnell; Supplier Part Number 4: 2376927; Supplier 5: Newark; Supplier Part Number 5: 23X6019; Supplier 6: Newark; Supplier Part Number 6: 28M3820; Supplier 7: Mouser; Supplier Part Number 7: 584-ADP1715ARMZ3.3R7; Packing: Reel; Mounting Technology: Surface Mount; Code_JEDEC: MO-187-AA; PartNumber: ADP1715ARMZ-3.3-R7; ComponentLink1Description: Manufacturer URL; ComponentLink1URL: http://www.analog.com/en/index.html; ComponentLink2Description: Datasheet; ComponentLink2URL: http://www.analog.com/static/imported-files/data_sheets/ADP1715_1716.pdf; ComponentLink3Description: Package Specification; ComponentLink3URL: http://www.analog.com/static/imported-files/packages/PKG_PDF/MSOP%28RM%29/RM_8.pdf; ComponentLink4Description: URL Link1; ComponentLink4URL: Product URL:http://www.analog.com/en/ADP1715/productSearch.html
USB_Micro#2 = 629105136821: as USB_Micro#1 on sheet SCH_BoargV1_2; ComponentLink1Description: Manufacturer; ComponentLink1URL: http://www.we-online.de; ComponentLink2Description: Datasheet; ComponentLink2URL: http://katalog.we-online.de/em/datasheet/629105136821.pdf; Part Number: 629105136821; Published Date: May 2018; Publisher: Wurth Elektronik; Orientation: Horizontal; Interface Type: Micro USB 2.0 Type B; Operating Temperature: -40 to 85 degC; Mounting Technology: SMT; Packaging: Tape and Reel
USB_mini = 65100516121: Mini USB 2.0 Type B Horizontal SMT 5 Contacts WR-COM; Rated Current: 1 A; Gender: Female; ComponentLink1Description: Manufacturer; ComponentLink1URL: http://www.we-online.de; ComponentLink2Description: Datasheet; ComponentLink2URL: http://katalog.we-online.de/em/datasheet/65100516121.pdf; Part Number: 65100516121; Published Date: May 2018; Publisher: Wurth Elektronik; Orientation: Horizontal; Interface Type: Mini USB 2.0 Type B; Operating Temperature: -40 to 105 degC; Mounting Technology: SMT; Packaging: Tray
Y1#2 = XTAL: Crystal Oscillator; Published: 8-Jun-2000; LatestRevisionDate: 17-Jul-2002; LatestRevisionNote: Re-released for DXP Platform.; PackageReference: R38; Publisher: Altium Limited; PackageDescription: Crystal, Thru-Hole; 2 Leads; Body 3.1 x 8.2 mm (Dia.xH)

## Nets that join several sheets
3.3V: SCH_BoargV1_2 (28 pins), SCH_BoargV1 (26 pins)
5V: SCH_BoargV1_2 (8 pins), SCH_BoargV1 (6 pins)
GND: SCH_BoargV1_2 (46 pins), SCH_BoargV1 (51 pins)
RESET: SCH_BoargV1_2 (5 pins), SCH_BoargV1 (C11#2.2 DD1#2.18 R6#2.2 S3#2.4)